# EAGLE design STorM32 NT imu v10 mini-mpu9250 (EAGLE 6.5.0)
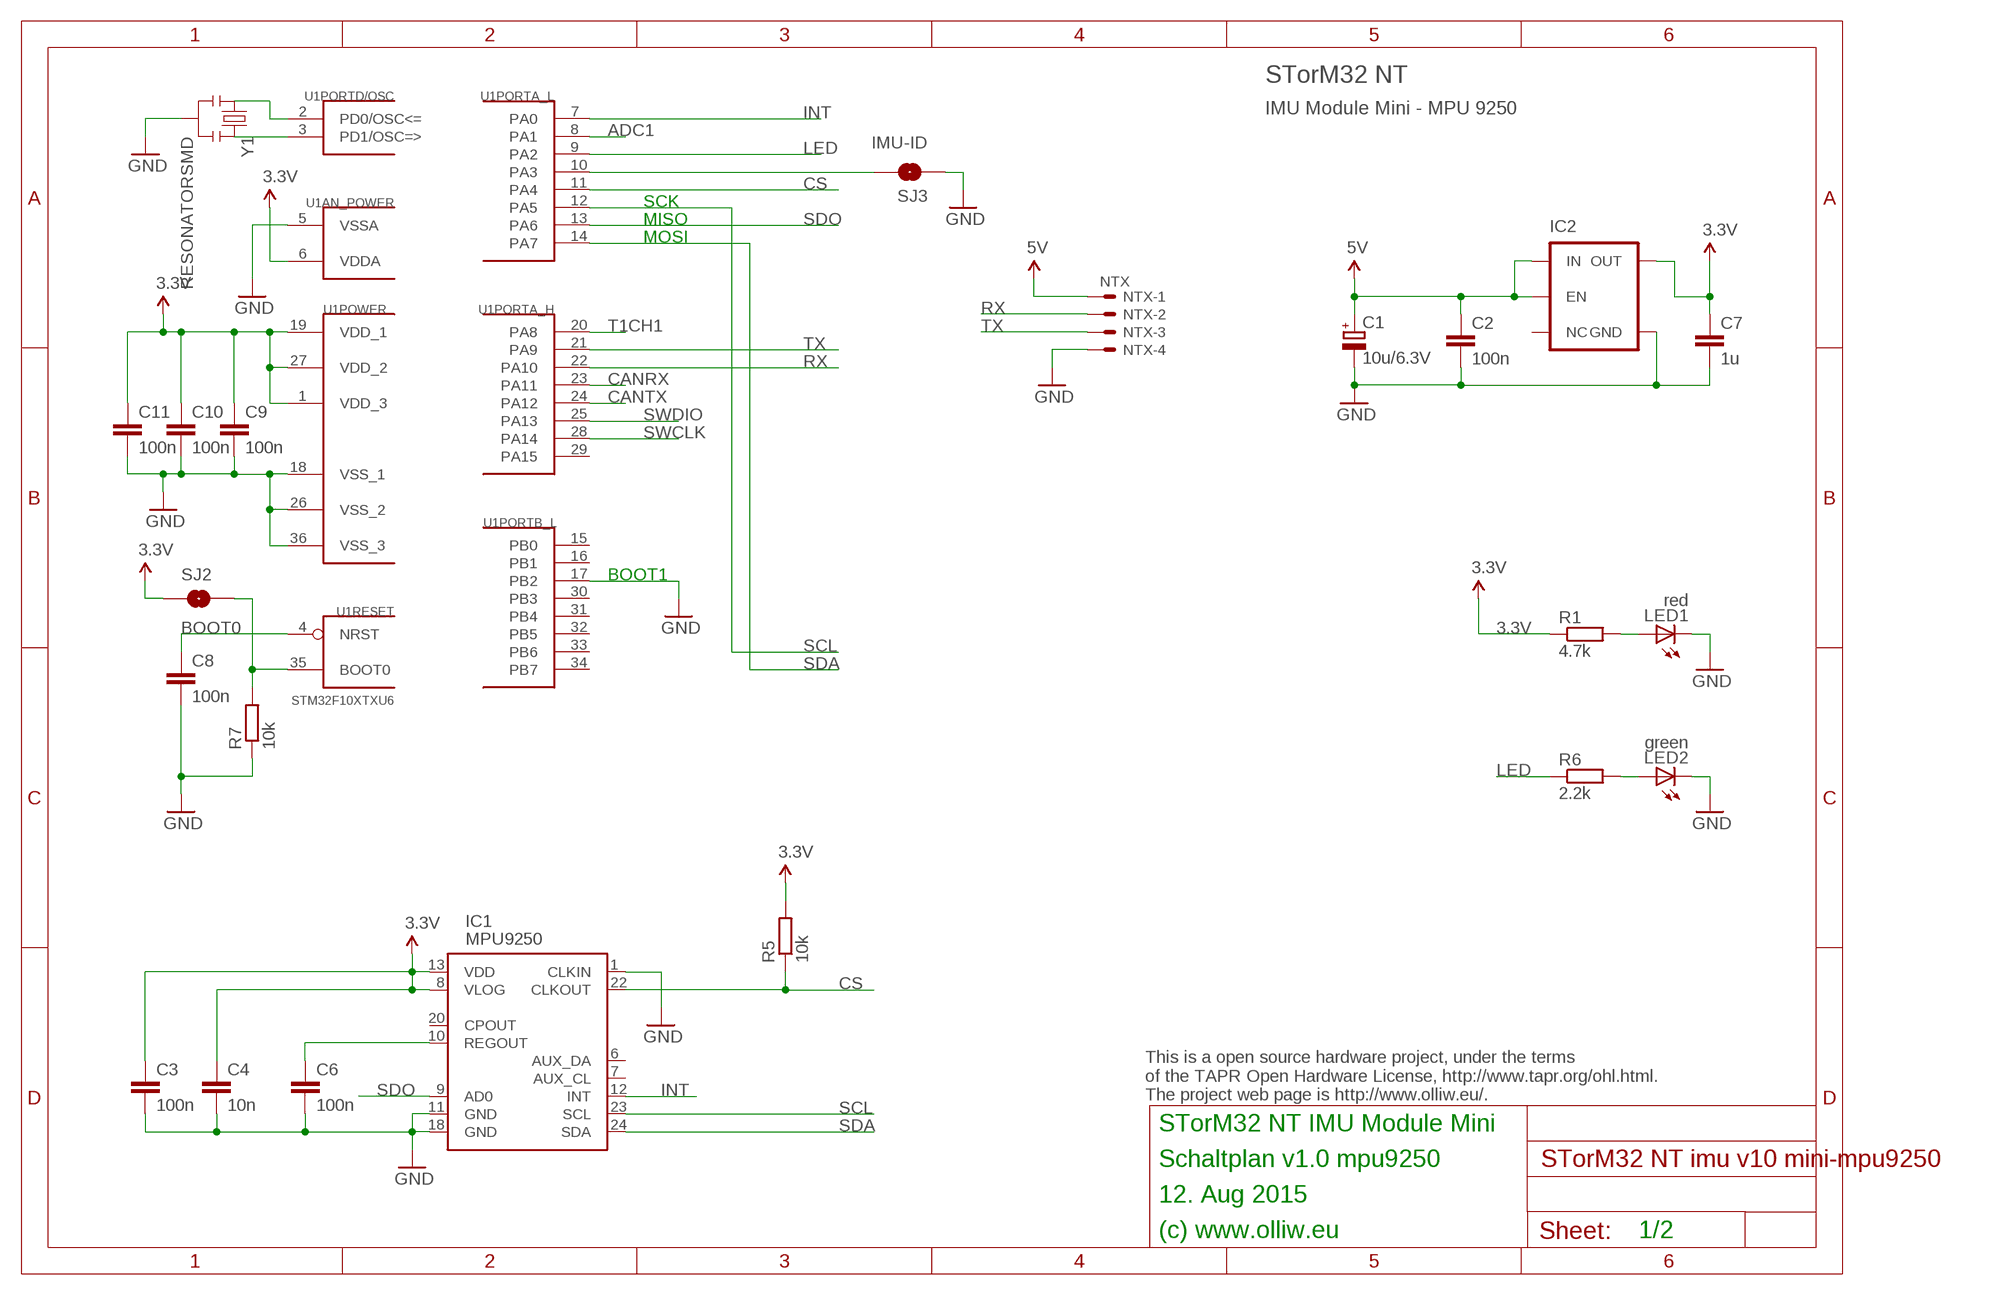
[diagram p0: schematic, sheet 1]

## Parts
C1  10u/6.3V  CPOL-EUSMCA  [SMC_A]
C2  100n  C-EUC0402  [C0402]
C3  100n  C-EUC0402  [C0402]
C4  10n  C-EUC0402  [C0402]
C6  100n  C-EUC0402  [C0402]
C7  1u  C-EUC0402  [C0402]
C8  100n  C-EUC0402  [C0402]
C9  100n  C-EUC0402  [C0402]
C10  100n  C-EUC0402  [C0402]
C11  100n  C-EUC0402  [C0402]
IC1  MPU9250  IMU3000QFN-24-0.4MIL  [QFN-24-3X3]
IC2  V_REG_TPS76433SOT23-5  [SOT23-5]
LED1  red  LEDCHIPLED_0603  [CHIPLED_0603]
LED2  green  LEDCHIPLED_0603  [CHIPLED_0603]
NTX  NTX  SM04B-SRSS-TB  [SM04B-SRSS-TB]
R1  4.7k  R-EU_R0402  [R0402]
R5  10k  R-EU_R0402  [R0402]
R6  2.2k  R-EU_R0402  [R0402]
R7  10k  R-EU_R0402  [R0402]
SJ2  BOOT0  SOLDERJUMPERNO  [SJ_2S-NO]
SJ3  IMU-ID  SOLDERJUMPERNO  [SJ_2S-NO]
U1  STM32F10XTXU6  [VFQFPN36]
Y1  RESONATORSMD  [RESONATOR-SMD]

## Nets
3.3V: C3.1 C4.1 C7.1 C9.1 C10.1 C11.1 IC1.8(VLOG) IC1.13(VDD) IC2.5(OUT) R1.1 R5.2 SJ2.1 U1.1(POWER:VDD_3) U1.6(AN_POWER:VDDA) U1.19(POWER:VDD_1) U1.27(POWER:VDD_2)
5V: C1.+ C2.1 IC2.1(IN) IC2.3(EN) NTX.1
ADC1: U1.8(PORTA_L:PA1)
CANRX: U1.23(PORTA_H:PA11)
CANTX: U1.24(PORTA_H:PA12)
CS: IC1.22(CLKOUT) R5.1 U1.11(PORTA_L:PA4)
GND: C1.- C2.2 C3.2 C4.2 C6.2 C7.2 C8.2 C9.2 C10.2 C11.2 IC1.1(CLKIN) IC1.11(GND) IC1.18(GND) IC2.2(GND) LED1.C LED2.C NTX.4 R7.1 SJ3.1 U1.5(AN_POWER:VSSA) U1.17(PORTB_L:PB2) U1.18(POWER:VSS_1) U1.26(POWER:VSS_2) U1.36(POWER:VSS_3) Y1.2
INT: IC1.12(INT) U1.7(PORTA_L:PA0)
LED: R6.1 U1.9(PORTA_L:PA2)
N$1: C8.1 U1.4(RESET:NRST)
N$2: LED2.A R6.2
N$3: R7.2 SJ2.2 U1.35(RESET:BOOT0)
N$5: U1.2(PORTD/OSC:PD0/OSC<=) Y1.1
N$6: U1.3(PORTD/OSC:PD1/OSC=>) Y1.3
N$9: LED1.A R1.2
N$20: C6.1 IC1.10(REGOUT)
RX: NTX.2 U1.22(PORTA_H:PA10)
RX2: SJ3.2 U1.10(PORTA_L:PA3)
SCL: IC1.23(SCL) U1.12(PORTA_L:PA5)
SDA: IC1.24(SDA) U1.14(PORTA_L:PA7)
SDO: IC1.9(AD0) U1.13(PORTA_L:PA6)
SWCLK: U1.28(PORTA_H:PA14)
SWDIO: U1.25(PORTA_H:PA13)
T1CH1: U1.20(PORTA_H:PA8)
TX: NTX.3 U1.21(PORTA_H:PA9)
Unconnected: IC1.6(AUX_DA) IC1.7(AUX_CL) IC1.20(CPOUT) IC2.4(NC) U1.15(PORTB_L:PB0) U1.16(PORTB_L:PB1) U1.29(PORTA_H:PA15) U1.30(PORTB_L:PB3) U1.31(PORTB_L:PB4) U1.32(PORTB_L:PB5) U1.33(PORTB_L:PB6) U1.34(PORTB_L:PB7)

## Notes on the sheet
- STorM32 NT
- IMU Module Mini - MPU 9250
- SCK
- MISO
- MOSI
- BOOT1
- This is a open source hardware project, under the terms
  of the TAPR Open Hardware License, http://www.tapr.org/ohl.html.
  The project web page is http://www.olliw.eu/.
- STorM32 NT IMU Module Mini
- Schaltplan v1.0 mpu9250
- 12. Aug 2015
- (c) www.olliw.eu | 1/2

## Library data of the parts
C1 = rcl:CPOL-EU: POLARIZED CAPACITOR, European symbol
C2-C4 C6-C11 = rcl:C-EU: CAPACITOR, European symbol
IC1 = # SparkFun2:IMU3000
IC2 = # SparkFun2:V_REG_TPS76433: Voltage Regulator Older TI part. LDO 150mA regulator. No output by-pass cap option. See V_REG_LDO for a better part.
LED1 LED2 = led:LED: LED OSRAM: - CHIPLED LG R971, LG N971, LY N971, LG Q971, LY Q971, LO R971, LY R971 LH N974, LH R974 LS Q976, LO Q976, LY Q976 LO Q996 - Hyper CHIPLED LW Q18S LB Q993, LB Q99A, LB R99A - SideLED LS A670, LO A670, LY A670, LG A670, LP A670 LB A673, LV A673, LT A673, LW A673 LH A674 LY A675 LS A676, LA A676, LO A676, LY A676, LW A676 LS A679, LY A679, LG A679 - Hyper Micro SIDELED® LS Y876, LA Y876, LO Y876, LY Y876 LT Y87S - SmartLED LW L88C, LW L88S LB L89C, LB L89S, LG L890 LS L89K, LO L89K, LY L89K LS L896, LA L896, LO L896, LY L896 - TOPLED LS T670, LO T670, LY T670, LG T670, LP T670 LSG T670, LSP T670, LSY T670, LOP T670, LYG T670 LG T671, LOG T671, LSG T671 LB T673, LV T673, LT T673, LW T673 LH T674 LS T676, LA T676, LO T676, LY T676, LB T676, LH T676, LSB T676, LW T676 LB T67C, LV T67C, LT T67C, LS T67K, LO T67K, LY T67K, LW E67C LS E67B, LA E67B, LO E67B, LY E67B, LB E67C, LV E67C, LT E67C LW T67C LS T679, LY T679, LG T679 LS T770, LO T770, LY T770, LG T770, LP T770 LB T773, LV T773, LT T773, LW T773 LH T774 LS E675, LA E675, LY E675, LS T675 LS T776, LA T776, LO T776, LY T776, LB T776 LHGB T686 LT T68C, LB T68C - Hyper Mini TOPLED® LB M676 - Mini TOPLED Santana® LG M470 LS M47K, LO M47K, LY M47K Source: http://www.osram.convergy.de LUXEON: - LUMILED® LXK2-PW12-R00, LXK2-PW12-S00, LXK2-PW14-U00, LXK2-PW14-V00 LXK2-PM12-R00, LXK2-PM12-S00, LXK2-PM14-U00 LXK2-PE12-Q00, LXK2-PE12-R00, LXK2-PE12-S00, LXK2-PE14-T00, LXK2-PE14-U00 LXK2-PB12-K00, LXK2-PB12-L00, LXK2-PB12-M00, LXK2-PB14-N00, LXK2-PB14-P00, LXK2-PB14-Q00 LXK2-PR12-L00, LXK2-PR12-M00, LXK2-PR14-Q00, LXK2-PR14-R00 LXK2-PD12-Q00, LXK2-PD12-R00, LXK2-PD12-S00 LXK2-PH12-R00, LXK2-PH12-S00 LXK2-PL12-P00, LXK2-PL12-Q00, LXK2-PL12-R00 Source: www.luxeon.com KINGBRIGHT: KA-3528ASYC Source: www.kingbright.com
NTX = con-jst2:?M04B-SRSS-TB: Disconnectable Crimp style connector, 1.0mm pitch 4 contacts
R1 R5-R7 = rcl:R-EU_: RESISTOR, European symbol
SJ2 SJ3 = # SparkFun2:SOLDERJUMPER: Solder Jumper Standard SMD solder jumper. Used to automate production. Two varients : Normally Open and Normally Closed are the same, but have different paste layers. NC will have a large amount of paste and should jumper during reflow.
U1 = # stm32:STM32F10XTXU6: STM32F101/103 36pad VFQPFN36
Y1 = # SparkFun2:RESONATOR: Resonator Small SMD resonator. This is the itty bitty 10/20MHz resonators with built in caps. CSTCE10M0G55 and CSTCE20M0V53. Footprint has been reviewed closely but hasn't been tested yet.

## Board
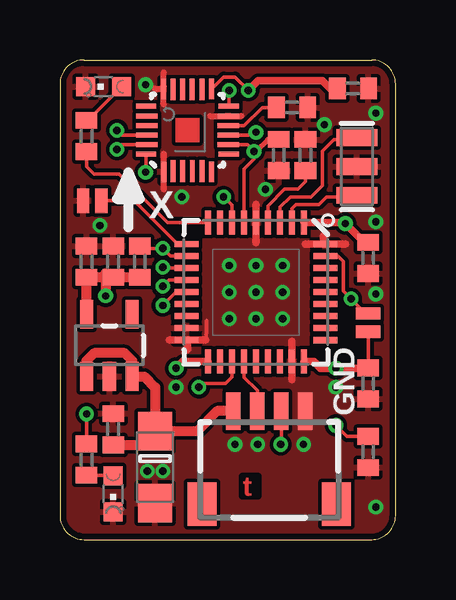
[diagram p1: board, top side]
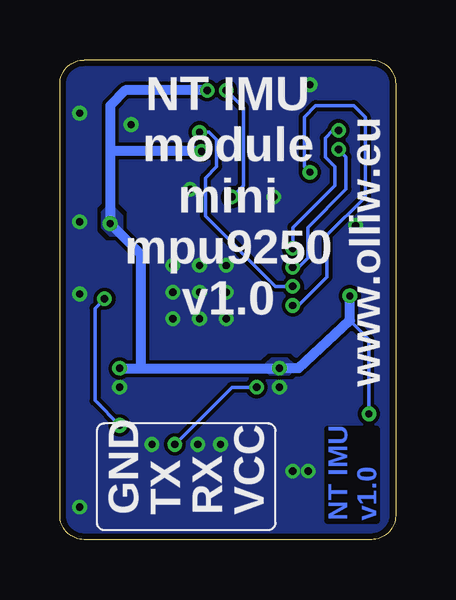
[diagram p2: board, bottom side, seen from below]

Size 14 x 20 mm. Coordinates in mm from the lower left corner, seen from the top.
Outline: 1,20 13,20 arc-90 14,19 14,1 arc-90 13,0 1,0 arc-90 0,1 0,19 arc-90 1,20
Copper layers (1*16): Top 0.035mm / dielectric 1.5mm / Bottom 0.035mm
Design rules "Fusion_eagle_rule_v1.1-shapes-supply-changed": minimum track width 6mil, minimum drill 12mil, track to track 6mil, track to pad 6mil, pad to pad 6mil, via to via 6mil, smd to smd 0mil, copper to edge 10mil, drill to drill 10mil, minimum pad ring 10mil, minimum via ring 6mil, stop-mask expansion 2mil, vias tented up to drill 100mil, thermal gap 6mil

### Footprints (pad centres in the part's own frame; a part is rotated, then mirrored left to right if it is on the bottom)
SMC_A = smd 1.6 x 1.4: + -1.5,0; - 1.5,0
C0402 = smd 0.7 x 0.9: 1 -0.65,0; 2 0.65,0
QFN-24-3X3 = smd 0.85 x 0.21: 1 -1.725,1; 6 -1.725,-1; 13 1.725,-1; 18 1.725,1 | smd 0.9 x 0.21: 2 -1.7,0.6; 3 -1.7,0.2; 5 -1.7,-0.6; 14 1.7,-0.6; 15 1.7,-0.2; 16 1.7,0.2; 17 1.7,0.6 | smd 0.9 x 0.2: 4 -1.7,-0.2 | smd 0.21 x 0.85: 7 -1,-1.725; 12 1,-1.725; 19 1,1.725; 24 -1,1.725 | smd 0.21 x 0.9: 8 -0.6,-1.7; 9 -0.2,-1.7; 10 0.2,-1.7; 11 0.6,-1.7; 20 0.6,1.7; 21 0.2,1.7; 22 -0.2,1.7; 23 -0.6,1.7
SOT23-5 = smd 0.55 x 1.2: 1 -0.95,-1.3; 2 0,-1.3; 3 0.95,-1.3; 4 0.95,1.3; 5 -0.95,1.3
CHIPLED_0603 = smd 0.8 x 0.8: A 0,-0.75; C 0,0.75
SM04B-SRSS-TB = smd 0.6 x 1.55: 1 -1.5,2.975; 2 -0.5,2.975; 3 0.5,2.975; 4 1.5,2.975 | smd 1.2 x 1.8: FIT@1 -2.8,-0.9; FIT@2 2.8,-0.9
R0402 = smd 0.7 x 0.9: 1 -0.65,0; 2 0.65,0
SJ_2S-NO = smd 0.508 x 1.016: 1 -0.381,0; 2 0.381,0
VFQFPN36 = smd 1 x 0.25: 1 -2.9,2; 2 -2.9,1.5; 3 -2.9,1; 4 -2.9,0.5; 5 -2.9,0; 6 -2.9,-0.5; 7 -2.9,-1; 8 -2.9,-1.5; 9 -2.9,-2; 19 2.9,-2; 20 2.9,-1.5; 21 2.9,-1; 22 2.9,-0.5; 23 2.9,0; 24 2.9,0.5; 25 2.9,1; 26 2.9,1.5; 27 2.9,2 | smd 0.25 x 1: 10 -2,-2.9; 11 -1.5,-2.9; 12 -1,-2.9; 13 -0.5,-2.9; 14 0,-2.9; 15 0.5,-2.9; 16 1,-2.9; 17 1.5,-2.9; 18 2,-2.9; 29 1.5,2.9; 30 1,2.9; 31 0.5,2.9; 32 0,2.9; 33 -0.5,2.9; 34 -1,2.9; 35 -1.5,2.9; 36 -2,2.9 | smd 0.27 x 1: 28 2,2.9
RESONATOR-SMD = smd 0.7 x 1.7: 1 -1.2,0; 2 0,0; 3 1.2,0

### Placement (x,y rotation side)
C1  3.97,3.02 270 top
C2  2.22,4.6 90 top
C3  12.22,18.81 0 top
C4  9.13,16.03 270 top
C6  9.68,18.02 0 top
C7  1.11,11.59 90 top
C8  10.24,16.03 90 top
C9  12.86,6.51 270 top
C10  2.22,11.59 90 top
C11  12.86,11.75 270 top
IC1  5.32,17.07 90 top
IC2  2.06,8.1 0 top
LED1  2.22,1.91 180 top
LED2  1.83,18.89 90 top
NTX  8.73,2.38 0 top
R1  1.11,3.33 270 top
R5  3.33,11.59 270 top
R6  1.11,16.83 90 top
R7  12.86,3.65 90 top
SJ2  12.86,9.05 90 top
SJ3  1.35,14.13 0 top
U1  8.18,10.32 270 top
Y1  12.38,15.56 90 top

### Tracks (layer width: path | path; a pad name or v marks a point on that pad's centre or on a via)
3.3V  (via drill 0.3)
  Top 0.152: IC2.5 1.11,9.56 | 13,7.14 C9.1 SJ2.1 | R5.2 1.91,11.11 | 11.86,13.22 v11.91,13.18 | U1.6 7.68,15.45 8.1,15.88 v8.1,16.19 | R1.1 v1.11,5.24 | IC1.8 7.82,16.47 v8.1,16.19 | IC1.13 6.83,19.29 7.3,19.29 v7.86,18.73 | v8.1,16.19 8.18,16.19
  Top 0.203: 8.18,16.19 8.67,16.68 C4.1
  Top 0.305: U1.27 10.6,7.42 10.87,7.14 v11.51,7.14 13,7.14 | v4.84,7.14 5.12,7.42 U1.19 | C11.1 12.69,12.4 v11.91,13.18 | U1.1 11.86,13.22 | C3.1 11.27,18.81 10.95,19.13 8.26,19.13 v7.86,18.73
  Top 0.406: 1.11,9.56 C7.1 C10.1 R5.2 | 1.91,11.11 v1.91,10.16
  Bottom 0.152: v1.11,5.24 1.11,8.33 1.91,9.13
  Bottom 0.406: v11.51,7.14 10.64,7.14 | 10.64,7.14 v4.84,7.14 4.05,7.14 1.91,9.13 v1.91,10.16 | v7.86,18.73 11.27,18.73 11.91,18.1 11.91,16.19 | 11.91,16.19 v11.91,13.18 10.64,11.91 10.64,7.14 | v8.1,16.19 11.91,16.19
  pour Bottom: 4.29,7.06 4.45,6.91 5.24,6.91 5.4,7.06 5.4,7.3 5.16,7.54 4.52,7.54 4.29,7.3
  pour Bottom: 11.43,13.49 11.75,13.81 12.06,13.81 12.22,13.65 12.22,13.02 11.91,12.7 11.43,12.7
5V
  Top 0.152: 3.41,3.95 C1.+
  Top 0.406: NTX.1 6.55,5.36 5.71,4.52 C1.+ 3.97,6.35 3.52,6.8 IC2.3 3.01,7.46 2.7,7.78 1.43,7.78 1.11,7.46 IC2.1 | C2.1 3.41,3.95
CS  (via drill 0.3)
  Top 0.152: U1.11 4.61,11.82 v4.29,12.14 3.4,12.14 R5.1 | IC1.22 2.58,16.87 v2.38,17.07
  Bottom 0.152: v4.29,12.14 4.29,13.02 2.54,14.76 2.54,15.56 2.94,15.95 2.94,16.75 2.62,17.07 v2.38,17.07
GND  (via drill 0.3 pad 0.61)
  Top 0.152: 6.07,8.32 6.11,8.68 6.11,9.13 | IC1.11 6.75,17.66 6.27,17.66 | 10.99,12.38 11.06,12.64 U1.36 | 5.4,8.32 5.2,8.24 U1.18 5.36,8.3 5.32,7.94 | 4.33,18.89 4.24,18.88 IC1.18 4.21,18.84 4.21,18.81 | IC1.1 4.32,14.93 4.33,14.61
  Top 0.254: 4.33,16.07 4.33,14.61 | 6.27,17.66 7.57,17.66 | 4.33,18.14 4.33,18.89 4.33,19.49 | 3.93,18.81 4.21,18.81
  Top 0.305: 8.18,13.97 8.18,12.38 | 11.91,12.31 10.24,12.31 | 4.56,8.32 5.4,8.32 6.07,8.32 | 10.99,12.38 10.99,12.66 | 5.32,8.26 5.32,7.94 | 9.68,8.26 9.68,6.67
  other vias: 7.06,10.32 9.29,10.32 8.18,10.32 7.06,9.21 8.18,9.21 9.29,9.21 10.16,3.97 7.3,3.97 7.06,11.43 8.18,11.43 9.29,11.43 4.84,6.35 11.51,6.35 1.67,13.1 13.18,17.78 13.18,13.26 13.18,10.24 3.65,2.86 4.29,2.86 5.08,14.29 3.57,18.97 8.57,14.61 11.03,17.3 13.18,1.35 8.26,3.97
  pour Bottom (isolate 0.152, rank 2): 0.33,19.06 arc-90 1,19.73 13.05,19.73 arc-90 13.72,19.06 13.72,1 arc-90 13.05,0.33 1,0.33 arc-90 0.33,1
  pour Top (isolate 0.152): 0.33,19.06 arc-90 1,19.73 13.05,19.73 arc-90 13.72,19.06 13.72,1 arc-90 13.05,0.33 1,0.33 arc-90 0.33,1
  pour Top (no thermals): 9.76,6.35 10.87,6.35 10.87,4.13 9.76,4.13
INT  (via drill 0.3)
  Top 0.152: U1.7 7.18,13.94 v6.83,14.29 | IC1.12 7.04,18.71 v7.06,18.73
  Bottom 0.152: v6.83,14.29 6.35,14.76 6.35,18.02 v7.06,18.73
LED
  Top 0.152: U1.9 4.48,13.22 2.46,15.24 1.43,15.24 1.11,15.56 R6.1
N$1
  Top 0.152: U1.4 8.68,13.91 9.37,14.61 9.92,14.61 10.24,14.92 10.24,15.4 10.08,15.56 C8.1
N$2
  Top 0.152: LED2.A 1.16,17.48 R6.2
N$3  (via drill 0.3)
  Top 0.152: U1.35 11.6,11.82 11.83,11.59 11.83,10.36 v12.14,10.04 12.86,9.33 SJ2.2 | 12.84,4.45 R7.2 11.97,4.3 v11.51,4.76
  Bottom 0.152: v12.14,10.04 12.54,9.64 12.54,5.79 v11.51,4.76
N$5
  Top 0.152: U1.2 9.68,13.8 9.84,13.97 10.79,13.97 11.11,14.29 12.31,14.29 Y1.1
N$6
  Top 0.152: U1.3 9.18,13.86 9.6,14.29 10.48,14.29 10.95,14.76 10.95,16.19 11.43,16.67 12.29,16.67 Y1.3
N$9
  Top 0.152: R1.2 2.19,2.68 LED1.A
N$20
  Top 0.152: IC1.10 7.69,17.27 8.44,18.02 C6.1
RX
  Top 0.152: U1.22 7.68,6.77 8.23,6.21 NTX.2
RX2
  Top 0.152: U1.10 4.91,12.32 3.1,14.13 SJ3.2
SCL  (via drill 0.3)
  Top 0.152: v4.29,11.35 4.33,11.32 U1.12 | IC1.23 2.58,16.47 v2.38,16.27
  Bottom 0.152: v2.38,16.27 2.06,15.95 2.06,14.61 3.65,13.02 3.65,12.06 3.65,11.99 3.65,11.75 4.05,11.35 v4.29,11.35
SDA  (via drill 0.3)
  Top 0.152: v4.29,9.76 4.84,10.32 U1.14 | IC1.24 3.59,15.42 v3.57,15.32
  Bottom 0.152: v3.57,15.32 3.81,15.56 3.81,17.62 3.33,18.1 1.75,18.1 1.27,17.62 1.27,14.29 2.86,12.7 2.86,10.95 4.05,9.76 v4.29,9.76
SDO  (via drill 0.3)
  Top 0.152: U1.13 4.55,10.82 v4.29,10.56 | IC1.9 8.05,16.87 v8.18,16.99
  Bottom 0.152: v8.18,16.99 7.78,16.99 7.46,16.67 7.46,15.56 7.94,15.08 7.94,13.49 5,10.56 v4.29,10.56
TX  (via drill 0.3)
  Top 0.152: v9.21,3.97 9.23,3.99 NTX.3 | U1.21 7.18,6.78 6.91,6.51 5.95,6.51 v5.79,6.35
  Bottom 0.152: v5.79,6.35 6.83,6.35 v9.21,3.97

### Text on the board
Top: t
Bottom: NT IMU / v1.0
tNames: X | GND
bNames: www.olliw.eu | NT IMU / module / mini / mpu9250 / v1.0 | VCC | RX | TX | GND